# Altium schematic sheet Cooling.SchDoc: <Document>
size Letter; Engineer: <Engineer>; Organization: UPEL; Address1: USU Power Electronics Lab; Address2: USTAR Building 620, RM 118; Address3: 1600 N 620 E; Address4: North Logan, UT 84341; Revision: v1; SheetNumber: 8; SheetTotal: 21; ProjectName: <Project>
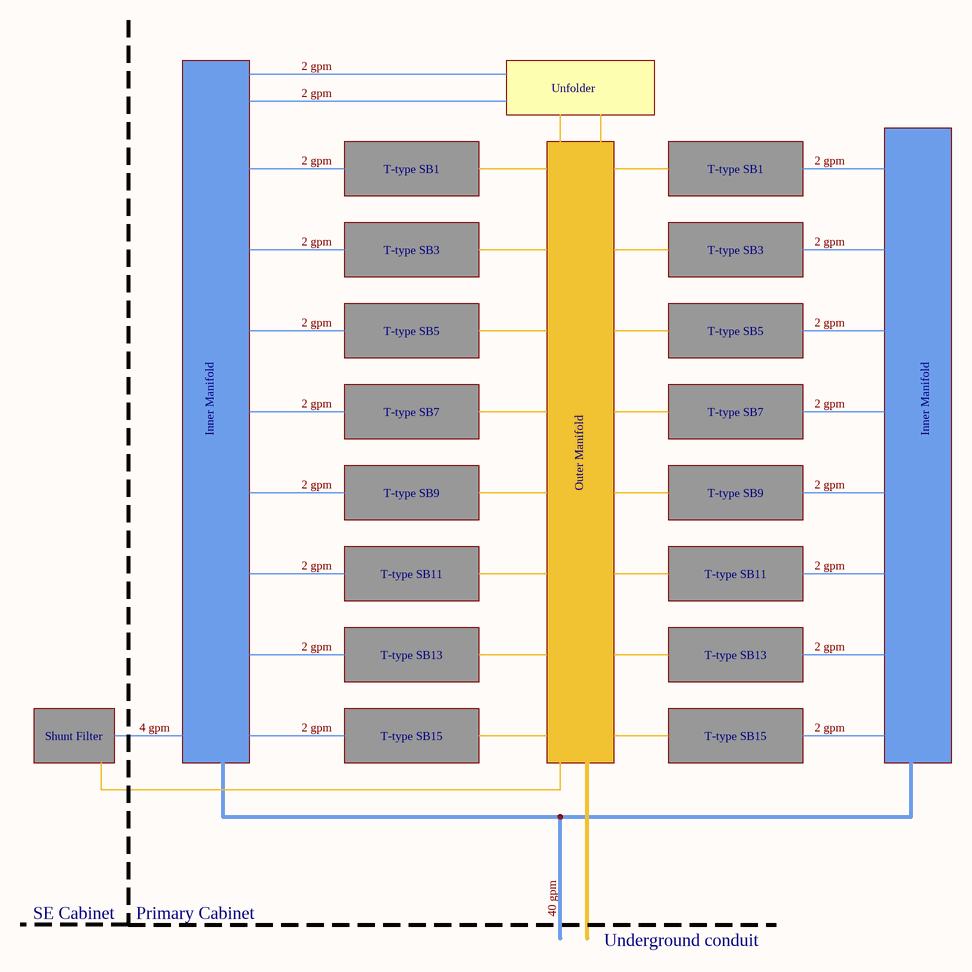
[diagram p0: Cooling.SchDoc]

## Notes on the sheet
- Unfolder
- T-type SB1
- T-type SB3
- T-type SB5
- Inner Manifold
- T-type SB7
- T-type SB9
- Outer Manifold
- T-type SB11
- T-type SB13
- Shunt Filter
- T-type SB15
- SE Cabinet
- Primary Cabinet
- Underground conduit
- Project:
- Engineer:
- Document:
- Approved By:
- Date:
- Revision:
- File:
- Sheet
- of